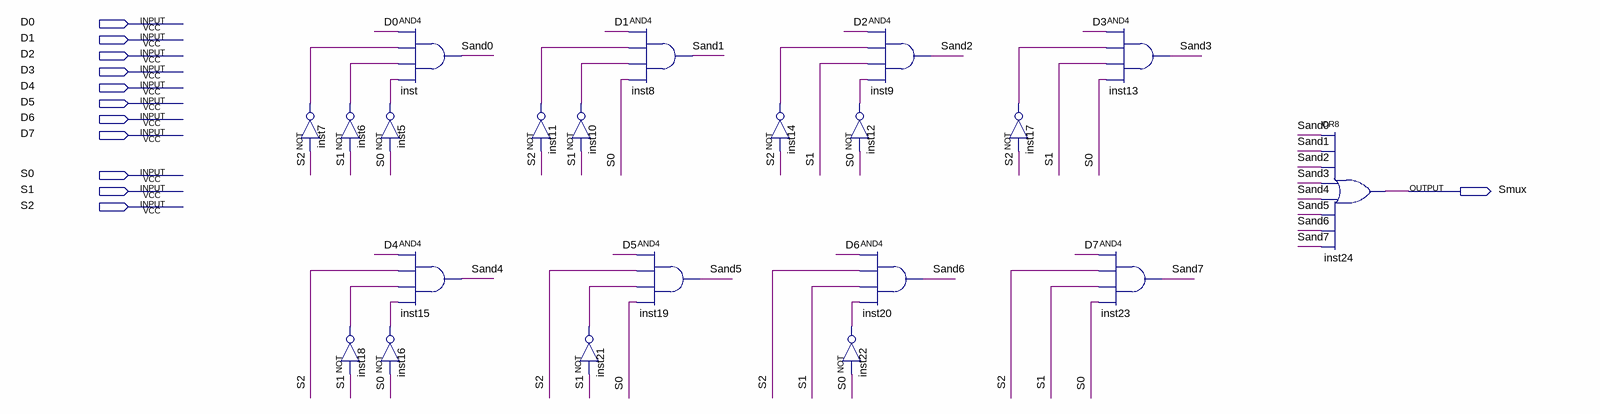
[diagram p0: schematic sheet]
// Quartus schematic mux8x1.bdf as structural Verilog: 21 symbols, 12 pins
module mux8x1 (
  input  D0,
  input  D1,
  input  D2,
  input  D3,
  input  D4,
  input  D5,
  input  D6,
  input  D7,
  input  S0,
  input  S1,
  input  S2,
  output Smux
);

  wire inst5_out, inst6_out, inst7_out, inst10_out, inst11_out, inst12_out, inst14_out, inst16_out,
       inst17_out, inst18_out, inst21_out, inst22_out, Sand0, Sand1, Sand2, Sand3, Sand4, Sand5, Sand6, Sand7;

  not inst7 (inst7_out, S2);
  not inst5 (inst5_out, S0);
  not inst6 (inst6_out, S1);
  not inst16 (inst16_out, S0);
  not inst18 (inst18_out, S1);
  and inst (Sand0, D0, inst7_out, inst6_out, inst5_out);
  and inst15 (Sand4, D4, S2, inst18_out, inst16_out);
  not inst10 (inst10_out, S1);
  not inst11 (inst11_out, S2);
  not inst21 (inst21_out, S1);
  and inst8 (Sand1, D1, inst11_out, inst10_out, S0);
  and inst19 (Sand5, D5, S2, inst21_out, S0);
  not inst14 (inst14_out, S2);
  and inst9 (Sand2, D2, inst14_out, S1, inst12_out);
  not inst12 (inst12_out, S0);
  and inst20 (Sand6, D6, S2, S1, inst22_out);
  not inst22 (inst22_out, S0);
  not inst17 (inst17_out, S2);
  and inst13 (Sand3, D3, inst17_out, S1, S0);
  and inst23 (Sand7, D7, S2, S1, S0);
  or inst24 (Smux, Sand0, Sand1, Sand2, Sand3, Sand4, Sand5, Sand6, Sand7);
endmodule
